# Altium schematic sheet DE-290817_01.SchDoc: Microcontroller - Memory - Display
size A3; Author: eldar6776@hotmail.com; DrawnBy: Eldar Dedić; Organization: I-MEDIA GROUP d.o.o.; Address1: Topal Osman Paše 18; Address2: 71000 Sarajevo; Address3: Federacija BiH; Address4: Bosna i Hercegovina; DocumentNumber: 1; Revision: 001; SheetNumber: 1; SheetTotal: 2; DocumentName: DE-290817; ProjectName: Hotel Room Access Controller Unit
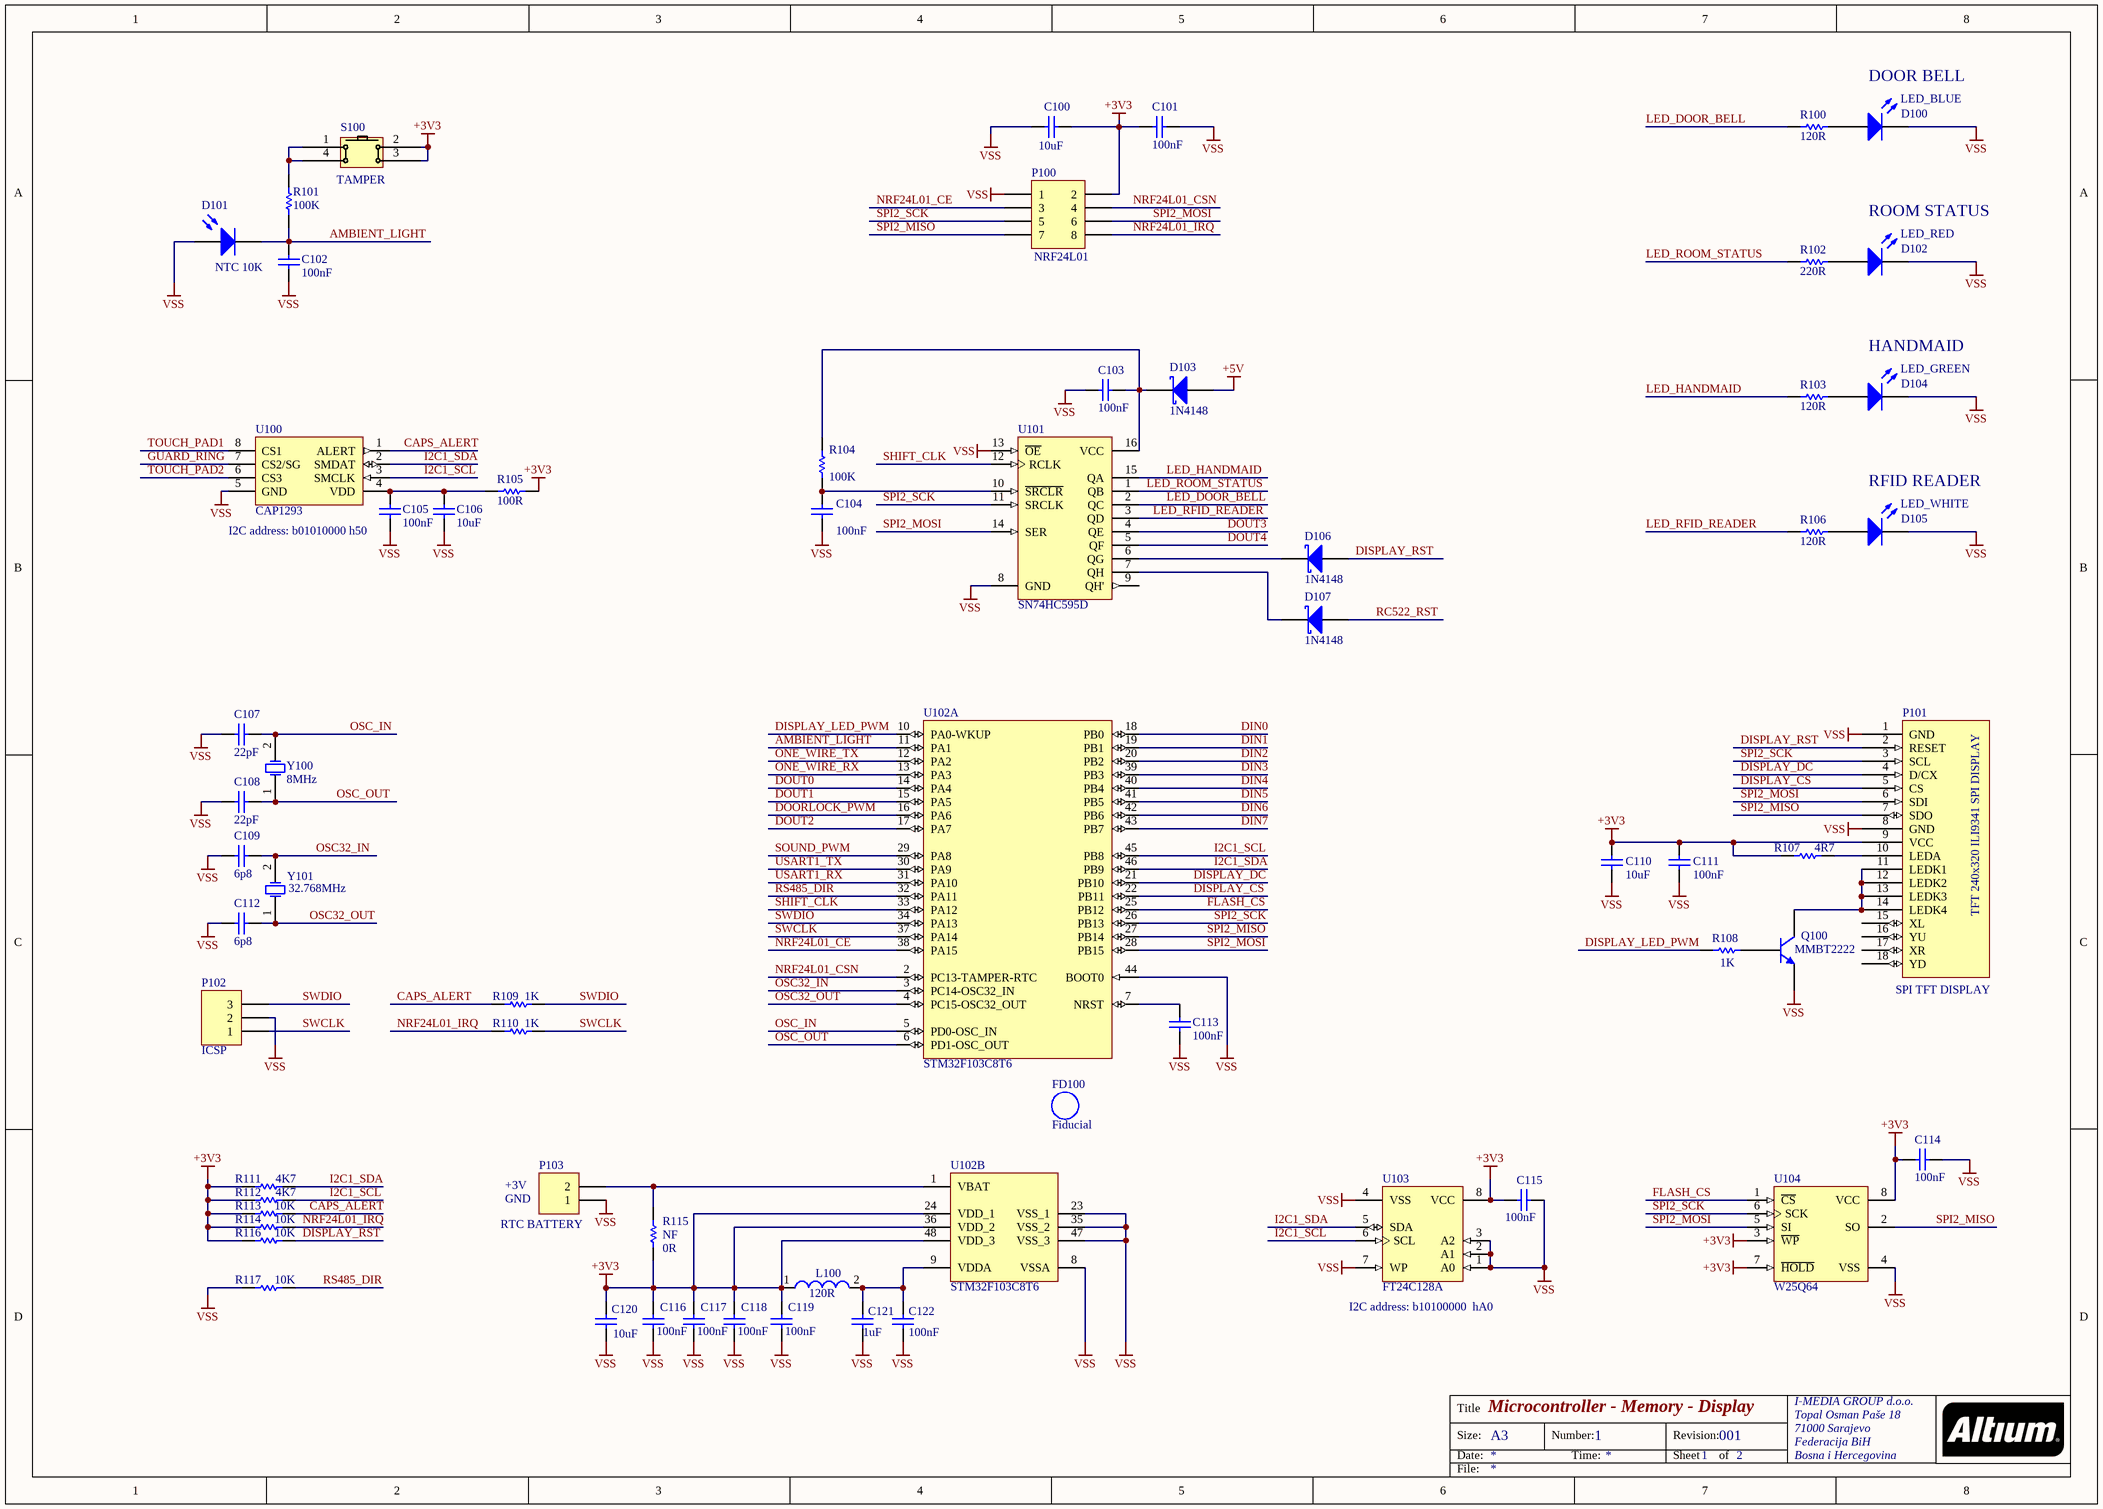
[diagram p0: DE-290817_01.SchDoc]

## Parts
C100  10uF  [0805]
C101  100nF  [0603]
C102  100nF  [0603]
C103  100nF  [0603]
C104  100nF  [0603]
C105  100nF  [0603]
C106  10uF  [0805]
C107  22pF  [0603]
C108  22pF  [0603]
C109  6p8  [0603]
C110  10uF  [0805]
C111  100nF  [0603]
C112  6p8  [0603]
C113  100nF  [0603]
C114  100nF  [0603]
C115  100nF  [0603]
C116  100nF  [0603]
C117  100nF  [0603]
C118  100nF  [0603]
C119  100nF  [0603]
C120  10uF  [0805]
C121  1uF  [0603]
C122  100nF  [0603]
D100  LED_BLUE  [1.6X0.8X0.8]
D101  NTC 10K  [PIN2]
D102  LED_RED  [1.6X0.8X0.8]
D103  1N4148  [SOD323]
D104  LED_GREEN  [1.6X0.8X0.8]
D105  LED_WHITE  [1.6X0.8X0.8]
D106  1N4148  [SOD323]
D107  1N4148  [SOD323]
FD100  Fiducial  [Fiducial]  (no BOM)
L100  120R  [SMD-0805]
P100  NRF24L01  [HDR2X4]
P101  SPI TFT DISPLAY  [DISPLAY CON]
P102  ICSP  [ICSP]
P103  RTC BATTERY  [HDR1X2]
Q100  MMBT2222  [SOT23_N]
R100  120R  [ERA-0603]
R101  100K  [ERA-0603]
R102  220R  [ERA-0603]
R103  120R  [ERA-0603]
R104  100K  [ERA-0603]
R105  100R  [ERA-0603]
R106  120R  [ERA-0603]
R107  4R7  [ERA-0603]
R108  1K  [ERA-0603]
R109  1K  [ERA-0603]
R110  1K  [ERA-0603]
R111  4K7  [ERA-0603]
R112  4K7  [ERA-0603]
R113  10K  [ERA-0603]
R114  10K  [ERA-0603]
R115  NF  value 0R  [ERA-0603]
R116  10K  [ERA-0603]
R117  10K  [ERA-0603]
S100  TAMPER  [TACTILE_SWITCH]
U100  CAP1293  [SOP8]
U101  SN74HC595D  [D016_N]
U102  STM32F103C8T6  [STM-LQFP48_N]  (parts A,B of 2)
U103  FT24C128A  [SOIC-SN8_N]
U104  W25Q64  [SOIJ-SM8_N]
Y100  8MHz  [HC49/4H_SMX]
Y101  32.768MHz  [R26]

## Nets
+3V3: C100.1 C101.1 C110.2 C111.1 C114.1 C115.1 C116.2 C117.2 C118.2 C119.2 C120.2 L100.1 P100.2 P101.9(VCC) R105.2 R107.1 R111.2 R112.2 R113.2 R114.2 R115.2 R116.2 S100.2 S100.3 U102.24(VDD_1) U102.36(VDD_2) U102.48(VDD_3) U103.8(VCC) U104.3(~{WP}) U104.7(~{HOLD}) U104.8(VCC)
+5V: D103.2(A)
VSS: C100.2 C101.2 C102.1 C103.2 C104.1 C105.2 C106.1 C107.2 C108.2 C109.2 C110.1 C111.2 C112.2 C113.2 C114.2 C115.2 C116.1 C117.1 C118.1 C119.1 C120.1 C121.1 C122.1 D100.2(K) D101.1(A) D102.2(K) D104.2(K) D105.2(K) P100.1 P101.1(GND) P101.8(GND) P102.2 P103.1 Q100.2(E) R117.2 U100.5(GND) U101.8(GND) U101.13(~{OE}) U102.8(VSSA) U102.23(VSS_1) U102.35(VSS_2) U102.44(BOOT0) U102.47(VSS_3) U103.1(A0) U103.2(A1) U103.3(A2) U103.4(VSS) U103.7(WP) U104.4(VSS)
AMBIENT_LIGHT: C102.2 D101.2(K) R101.2 U102.11(PA1)
CAPS_ALERT: R109.2 R113.1 U100.1(ALERT)
DIN0: U102.18(PB0)
DIN1: U102.19(PB1)
DIN2: U102.20(PB2)
DIN3: U102.39(PB3)
DIN4: U102.40(PB4)
DIN5: U102.41(PB5)
DIN6: U102.42(PB6)
DIN7: U102.43(PB7)
DISPLAY_CS: P101.5(CS) U102.22(PB11)
DISPLAY_DC: P101.4(D/CX) U102.21(PB10)
DISPLAY_LED_PWM: R108.1 U102.10(PA0-WKUP)
DISPLAY_RST: D106.2(A) P101.2(RESET) R116.1
DOORLOCK_PWM: U102.16(PA6)
DOUT0: U102.14(PA4)
DOUT1: U102.15(PA5)
DOUT2: U102.17(PA7)
DOUT3: U101.4(QE)
DOUT4: U101.5(QF)
FLASH_CS: U102.25(PB12) U104.1(~{CS})
GUARD_RING: U100.7(CS2/SG)
I2C1_SCL: R112.1 U100.3(SMCLK) U102.45(PB8) U103.6(SCL)
I2C1_SDA: R111.1 U100.2(SMDAT) U102.46(PB9) U103.5(SDA)
LED_DOOR_BELL: R100.2 U101.2(QC)
LED_HANDMAID: R103.2 U101.15(QA)
LED_RFID_READER: R106.2 U101.3(QD)
LED_ROOM_STATUS: R102.2 U101.1(QB)
NRF24L01_CE: P100.3 U102.38(PA15)
NRF24L01_CSN: P100.4 U102.2(PC13-TAMPER-RTC)
NRF24L01_IRQ: P100.8 R110.2 R114.1
ONE_WIRE_RX: U102.13(PA3)
ONE_WIRE_TX: U102.12(PA2)
OSC32_IN: C109.1 U102.3(PC14-OSC32_IN) Y101.2(OSC2)
OSC32_OUT: C112.1 U102.4(PC15-OSC32_OUT) Y101.1(OSC1)
OSC_IN: C107.1 U102.5(PD0-OSC_IN) Y100.2(OSC2)
OSC_OUT: C108.1 U102.6(PD1-OSC_OUT) Y100.1(OSC1)
RC522_RST: D107.2(A)
RS485_DIR: R117.1 U102.32(PA11)
SHIFT_CLK: U101.12(RCLK) U102.33(PA12)
SOUND_PWM: U102.29(PA8)
SPI2_MISO: P100.7 P101.7(SDO) U102.27(PB14) U104.2(SO)
SPI2_MOSI: P100.6 P101.6(SDI) U101.14(SER) U102.28(PB15) U104.5(SI)
SPI2_SCK: P100.5 P101.3(SCL) U101.11(SRCLK) U102.26(PB13) U104.6(SCK)
SWCLK: P102.1 R110.1 U102.37(PA14)
SWDIO: P102.3 R109.1 U102.34(PA13)
TOUCH_PAD1: U100.8(CS1)
TOUCH_PAD2: U100.6(CS3)
USART1_RX: U102.31(PA10)
USART1_TX: U102.30(PA9)
NetC103_1: C103.1 D103.1(K) R104.1 U101.16(VCC)
NetC104_2: C104.2 R104.2 U101.10(~{SRCLR})
NetC105_1: C105.1 C106.2 R105.1 U100.4(VDD)
NetC113_1: C113.1 U102.7(NRST)
NetC121_2: C121.2 C122.2 L100.2 U102.9(VDDA)
NetD100_1: D100.1(A) R100.1
NetD102_1: D102.1(A) R102.1
NetD104_1: D104.1(A) R103.1
NetD105_1: D105.1(A) R106.1
NetD106_1: D106.1(K) U101.6(QG)
NetD107_1: D107.1(K) U101.7(QH)
NetP101_10: P101.10(LEDA) R107.2
NetP101_11: P101.11(LEDK1) P101.12(LEDK2) P101.13(LEDK3) P101.14(LEDK4) Q100.3(C)
NetP103_2: P103.2 R115.1 U102.1(VBAT)
NetQ100_1: Q100.1(B) R108.2
NetR101_1: R101.1 S100.1 S100.4

Not connected (* = marked no-connect by the designer): P101 15(XL) 16(YU) 17(XR) 18(YD); U101 9(QH')

## Notes on the sheet
- DOOR BELL
- ROOM STATUS
- HANDMAID
- RFID READER
- (near C105) I2C address: b01010000 h50
- +3V
- GND
- (near U103) I2C address: b10100000  hA0
- Title
- Size:
- Date:
- A3
- Number:
- Time:
- Revision:
- Sheet
- of
- File:
- (in symbol DISPLAY CONNECTOR) TFT 240x320 ILI9341 SPI DISPLAY

## Library data of the parts
C100 C106 C110 C120 = C0805: Ceramic Chip Capacitor - Standard; Note: Footprint corresponds to dimensions for bulk cassette packaging. This case size has tightened tolerances.; Published: 17-Jul-2002; LatestRevisionDate: 19-Mar-2004; LatestRevisionNote: Silkscreen size reduced.; DatasheetDocument: Mar-2001; PackageDocument: Mar-2001; PackageReference: 0805; Publisher: Altium Limited; Code_JEITA: 0805; Code_IPC: 2012[0805]; ComponentLink1Description: Manufacturer Link; ComponentLink1URL: http://www.kemet.com/; ComponentLink2Description: Datasheet; ComponentLink2URL: http://www.kemet.com/kemet/web/homepage/kechome.nsf/vapubfilesname/F3102TA.pdf/$file/F3102TA.pdf; Value: 10uF
C101 C102 C104 C105 C107-C109 C111-C119 C121 C122 = C0603: Ceramic Chip Capacitor - Standard; Note: Footprint corresponds to dimensions for bulk cassette packaging. This case size has tightened tolerances.; Published: 17-Jul-2002; LatestRevisionDate: 19-Mar-2004; LatestRevisionNote: Silkscreen size reduced.; DatasheetDocument: Mar-2001; PackageDocument: Mar-2001; PackageReference: 0603; Publisher: Altium Limited; Code_JEITA: 0603; Code_IPC: 1608 [0603]; ComponentLink1Description: Manufacturer Link; ComponentLink1URL: http://www.kemet.com/; ComponentLink2Description: Datasheet; ComponentLink2URL: http://www.kemet.com/kemet/web/homepage/kechome.nsf/vapubfilesname/F3102TA.pdf/$file/F3102TA.pdf
  C104 C105 C111 C113 C115 C122: Value: 100nF
  C121: Value: 1uF
C103 = C0603: Ceramic Chip Capacitor - Standard; Note: Footprint corresponds to dimensions for bulk cassette packaging. This case size has tightened tolerances.; Value: 1uF; Published: 17-Jul-2002; LatestRevisionDate: 19-Mar-2004; LatestRevisionNote: Silkscreen size reduced.; DatasheetDocument: Mar-2001; PackageDocument: Mar-2001; PackageReference: 0603; Publisher: Altium Limited; Code_JEITA: 0603; Code_IPC: 1608 [0603]; ComponentLink1Description: Manufacturer Link; ComponentLink1URL: http://www.kemet.com/; ComponentLink2Description: Datasheet; ComponentLink2URL: http://www.kemet.com/kemet/web/homepage/kechome.nsf/vapubfilesname/F3102TA.pdf/$file/F3102TA.pdf
D100 D102 D104 D105 = HSMZ-C190: High Performance Chip LED, Red; LuminousIntensity: 40mcd (Minimum).; PCB_Layout: Complies with manufacturer's recommendation.; Published: 11-Dec-2002; DatasheetDocument: 11-Mar-2002; PackageDocument: 11-Mar-2002; PackageReference: 1.6X0.8X0.8; Publisher: Altium Limited; LED_Colour: Red; ComponentLink1Description: Manufacturer Link; ComponentLink1URL: http://www.agilent.com/; ComponentLink2Description: Datasheet; ComponentLink2URL: http://cp.literature.agilent.com/litweb/pdf/5988-5891EN.pdf
D101 = Photo Sen: Photosensitive Diode; Published: 24-Mar-1999; LatestRevisionDate: 17-Jul-2002; LatestRevisionNote: Re-released for DXP Platform.; PackageReference: PIN2; Publisher: Altium Limited
D103 D106 D107 = 1PS76SB10: Schottky Barrier Diode; Published: 17-Sep-2003; LatestRevisionDate: 19-Mar-2004; LatestRevisionNote: Silkscreen size reduced.; DatasheetVersion: 14-Oct-1996; PackageVersion: May-1999; PackageReference: SOD323; Publisher: Altium Limited; PackageDescription: SOD-323/SC-76; 2 Leads; Body 1.7 x 1.3 mm, (LxW); ComponentLink1Description: Manufacturer Link; ComponentLink1URL: http://www.semiconductors.philips.com/; ComponentLink2Description: Datasheet; ComponentLink2URL: http://www.semiconductors.philips.com/acrobat/datasheets/1PS76SB10_2.pdf
FD100 = Fiduchial: Fiduchial mark
L100 = 74279202: SMD EMI Suppression Ferrite Bead WE-CBF, Z = 120 Ohm; Impedance: 120 Ohm; DatasheetVersion: Dec-2005; PackageVersion: 2005; PackageReference: SMD-0805; PackageDescription: Chip Inductor, 2-Leads, Body 2.0 x 1.2 mm; ComponentLink1Description: Manufacturer URL; ComponentLink1URL: http://www.we-online.com; ComponentLink2Description: Datasheet; ComponentLink2URL: http://www.we-online.de/katalog/media/pdf/74279202.pdf
P100 = Header 4X2: Header, 4-Pin, Dual row; LatestRevisionDate: 17-Jul-2002; LatestRevisionNote: Re-released for DXP Platform.; Publisher: Altium Limited
P101 = DISPLAY CONNECTOR: DISPLAY ILI9341 240x320  CONNECTOR
P102 = ICSP: ICSP connection pads
P103 = Header 2: Header, 2-Pin; LatestRevisionDate: 17-Jul-2002; LatestRevisionNote: Re-released for DXP Platform.; Publisher: Altium Limited
Q100 = BC817: NPN General-purpose Transistor; Published: 17-Sep-2003; LatestRevisionDate: 12-Dec-2006; LatestRevisionNote: IPC-7351 Footprint Added.; DatasheetVersion: Jun-1999; PackageVersion: May-1999; PackageReference: SOT23; Publisher: Altium Limited; PackageDescription: 3-Pin SOT-23 Package 0.95 mm Pitch, 2.3 mm Lead Span; ComponentLink1Description: Manufacturer Link; ComponentLink1URL: http://www.semiconductors.philips.com/; ComponentLink2Description: Datasheet; ComponentLink2URL: http://www.semiconductors.philips.com/acrobat/datasheets/BC817_BC817W_BC337_5.pdf
R100-R117 = ERAV: Metal Film Thermosensitive Chip Resistor, 0.56 Ohm to 10k Ohm Range, 5% Tolerance, 0603 Size, 0.063 W; Note: If flow soldering, adjust pad width of PCB Footprint to 0.7 - 0.8 times the width of the resistor.; Published: 17-Dec-2003; LatestRevisionDate: 19-Mar-2004; LatestRevisionNote: Silkscreen size reduced.; PackageDocument: Mar-2003; PackageReference: ERA-0603; Publisher: Altium Limited; Code_IPC: 1608 [0603]; ComponentLink1Description: Manufacturer Link; ComponentLink1URL: http://www.panasonic.com/industrial/components/resistive_products.htm; ComponentLink2Description: Datasheet; ComponentLink2URL: http://www.panasonic.com/industrial/components/pdf/AOF0000CE1.pdf
  R104: Value: 100K
  R105: Value: 100R
S100 = TACKTILE_SWITCH
U100 = CAP1293: 3-Channel Capacitive Touch Sensor with Proximity Detection & Signal Guard
U101 = SN74HC595D: 8-Bit Shift Register with 3-State Output Registers; Published: 8-Jun-2000; LatestRevisionDate: 13-Apr-2006; LatestRevisionNote: IPC-7351 Footprint Added.; DatasheetVersion: May-1997; PackageVersion: Jan-1998; PackageReference: D016; Publisher: Altium Limited; PackageDescription: 16-Pin Small Outline Integrated Circuit 1.27 mm Pitch; Code_IPC: SOIC127P600-16; ComponentLink1Description: Manufacturer Link; ComponentLink1URL: http://www.ti.com/; ComponentLink2Description: Datasheet; ComponentLink2URL: http://www-s.ti.com/sc/ds/sn74hc595.pdf
U102 = STM32F103C8T6: ARM Cortex-M3 32-bit MCU, 64 KB Flash, 20 KB Internal RAM, 37 I/Os, 48-pin LQFP, -40 to 85 degC, Tray; A/D Converter: 2x12-bit (10 Channel); FLASH Size (Prog) (kB): 64; I/Os (High Current): 37; Internal RAM Size (kB): 20; Operating Frequency(F) (Processor speed) (MHz): 72; Supply Voltage(Vcc) min (V): 2; DatasheetVersion: Rev. 16; PackageVersion: Rev. 6, 06/2013; PackageReference: LQFP48; PackageDescription: 48-Pin Low Profile Quad Flat Package, 7 x 7 mm Body, 0.5 mm Pitch; Supplier 1: Digi-Key; Supplier Part Number 1: 497-6063-ND; Supplier 2: Farnell; Supplier Part Number 2: 1447637; Supplier 3: Newark; Supplier Part Number 3: 59M2182; Supplier 4: Newark; Supplier Part Number 4: 57P1222; Supplier 5: Mouser; Supplier Part Number 5: 511-STM32F103C8T6; Core: ARM Cortex-M3; Packing: Tray; Mounting Technology: Surface Mount; PartNumber: STM32F103C8T6; ComponentLink1Description: Manufacturer URL; ComponentLink1URL: http://www.st.com/web/en/home.html; ComponentLink2Description: Datasheet; ComponentLink2URL: http://www.st.com/st-web-ui/static/active/en/resource/technical/document/datasheet/CD00161566.pdf; ComponentLink3Description: Package Specification; ComponentLink3URL: http://www.st.com/st-web-ui/static/active/en/resource/technical/document/datasheet/DM00058181.pdf
U103 = 24AA64/SN: 64Kbit, 400kHz, 1.7V, I2C Serial EEPROM, 8-Pin SOIC 150mil, Commercial Temperature; Published: 29-Jan-2009; DatasheetVersion: revQ, Jun-2009; PackageVersion: revBB, Aug-2009; PackageReference: SOIC-SN8; Publisher: Altium Limited; PackageDescription: 8-Lead Plastic Small Outline (SN) - Narrow, 3.90mm Body [SOIC]; Supplier 1: Digi-Key; Supplier Part Number 1: 24AA64/SN-ND; Code_JEDEC: MS-012; Code_IPC: SOIC127P600-8; ComponentLink1Description: Datasheet; ComponentLink1URL: http://ww1.microchip.com/downloads/en/DeviceDoc/21189Q.pdf; ComponentLink2Description: Packaging Specification; ComponentLink2URL: http://www.microchip.com/stellent/groups/techpub_sg/documents/packagingspec/en012702.pdf; ComponentLink3Description: Microchip.com Home; ComponentLink3URL: http://www.microchip.com/
U104 = 25LC640A-I/SN: 64K SPI Bus Serial EEPROM, 8-Pin SOIC, Industrial Temperature; Published: 29-Jan-2009; LatestRevisionDate: 02-Dec-2009; LatestRevisionNote: Updated to datasheet revision D, Jan-2008; DatasheetVersion: revD, Oct-2008; PackageVersion: revBB, Aug-2009; PackageReference: SOIC-SN8; Publisher: Altium Limited; PackageDescription: 8-Lead Plastic Small Outline (SN) - Narrow, 3.90mm Body [SOIC]; Supplier 1: Digi-Key; Supplier Part Number 1: 25LC640A-I/SN-ND; Supplier 2: Farnell; Supplier Part Number 2: 1556155; Code_JEDEC: MS-012; Code_IPC: SOIC127P600-8; ComponentLink1Description: Datasheet; ComponentLink1URL: http://ww1.microchip.com/downloads/en/DeviceDoc/21830D.pdf; ComponentLink2Description: Packaging Specification; ComponentLink2URL: http://www.microchip.com/stellent/groups/techpub_sg/documents/packagingspec/en012702.pdf; ComponentLink3Description: Microchip.com Home; ComponentLink3URL: http://www.microchip.com/
Y100 = HC49/4H_SMX: Surface Mount Quartz Crystal; Note: PCB layout complies with manufacturer's recommendation.; Published: 17-Jul-2002; DatasheetDocument: 18-Oct-1999; PackageDocument: 18-Oct-1999; PackageReference: HC49/4H_SMX; Publisher: Altium Limited; ComponentLink1Description: Manufacturer Link; ComponentLink1URL: http://www.cmac.com/mt/; ComponentLink2Description: Datasheet; ComponentLink2URL: http://www.cmac.com/mt/databook/crystals/smd/hc49_4h_smx.pdf
Y101 = R26-32.768: Tuning Fork Crystal Unit; Published: 8-Jun-2000; LatestRevisionDate: 17-Jul-2002; LatestRevisionNote: Re-released for DXP Platform.; DatasheetDocument: 28-Sep-1998; PackageReference: R26; Publisher: Altium Limited; ComponentLink1Description: Manufacturer Link; ComponentLink1URL: http://www.raltron.com/products/microcrystals/default.asp; ComponentLink2Description: Datasheet; ComponentLink2URL: http://www.raltron.com/products/pdfspecs/crystal_r38_26_145.pdf